# Altium schematic sheet k26_baseboard_power_supply.SchDoc: k26 Baseboard Power Supply (part 2 of 3)
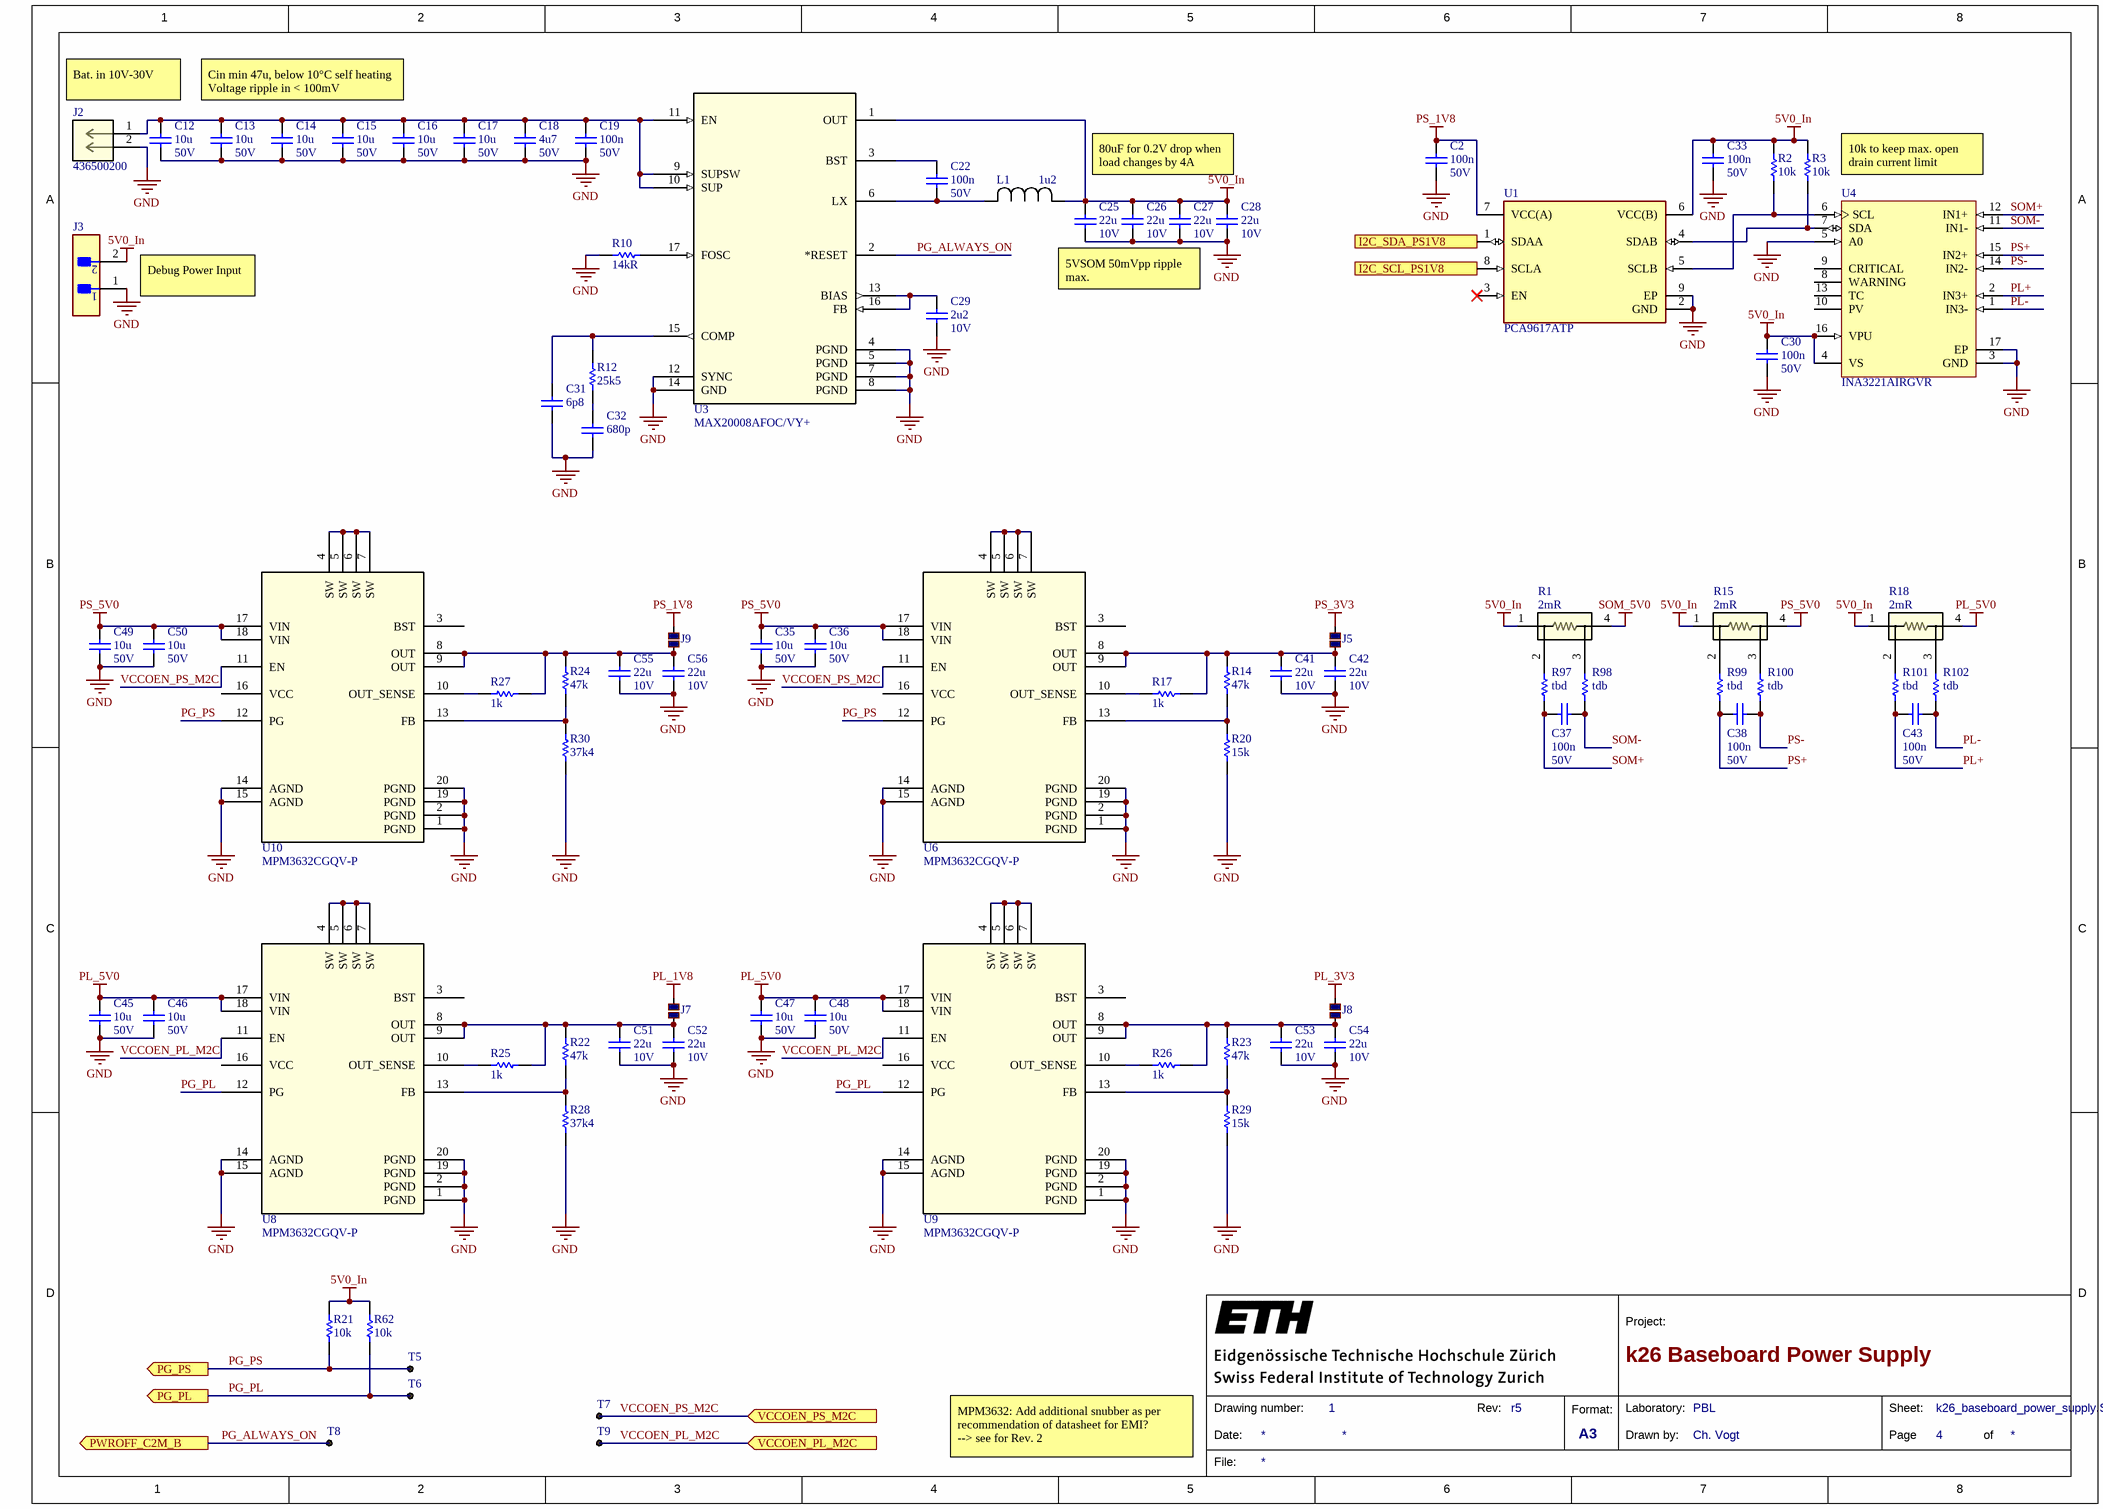
[diagram p1: k26_baseboard_power_supply.SchDoc]
## Library data of the parts
C2 C19 C22 C30 C33 C37 C38 C43 = cap0402: Ceramic Capacitor, Multilayer, Ceramic, 50V, 10% +Tol, 10% -Tol, X5R, 15% TC, 0.1uF, Surface Mount, 0402; Manufacturer: Yageo; Manufacturer Part Number: CC0402KRX5R9BB104; Capacitance: 100nF; Multilayer: Yes; Supplier 1: Farnell; Supplier Part Number 1: 3366442; RoHS: Yes; Category: Ceramic Capacitors; Stock 1: 180000; Pricing 1: 10000=0.00890, 50000=0.00870 (CHF); Mount: Surface Mount; Number of Pins: 2; Dielectric Material: Ceramic; Package Shape: Rectangular; Size Code: 0402; Terminal Finish: Nickel; Min Operating Temperature: -55°C; Max Operating Temperature: 85°C; JESD-609 Code: e3; Capacitor Type: Ceramic; Negative Tolerance: 10%; Temperature Characteristics Code: X5R; Termination: Wraparound; Positive Tolerance: 10%; Package Style: SMTMeter; Packaging: Tape and Reel; Length: 1mm; Width: 0.5mm; Height: 0.5mm; Reach SVHC Compliant: Yes; RoHS Compliant: Yes; ComponentLink1URL: https://datasheet.ciiva.com:443/pdfs/VipMasterIC/IC/YAGO/YAGO-S-A0006851646/YAGO-S-A0006851646-1.pdf?src-supplier=IHS+Markit; ComponentLink1Description: https://datasheet.ciiva.com:443/pdfs/VipMasterIC/IC/YAGO/YAGO-S-A0006851646/YAGO-S-A0006851646-1.pdf?src-supplier=IHS+Markit; ComponentLink2URL: http://www.yageo.com/documents/recent/UPY-GPHC_X5R_4V-to-50V_25.pdf?src-supplier=Digi-Key; ComponentLink2Description: http://www.yageo.com/documents/recent/UPY-GPHC_X5R_4V-to-50V_25.pdf?src-supplier=Digi-Key; ComponentLink3URL: http://www.yageo.com/documents/recent/UPY-GPHC_X5R_4V-to-50V_23.pdf?src-supplier=Digi-Key; ComponentLink3Description: http://www.yageo.com/documents/recent/UPY-GPHC_X5R_4V-to-50V_23.pdf?src-supplier=Digi-Key
C12-C17 C35 C36 C45-C50 = cap1206: Ceramic Capacitor, Multilayer, Ceramic, 50V, 10% +Tol, 10% -Tol, X5R, 15% TC, 10uF, Surface Mount, 1206; Manufacturer: Murata; Manufacturer Part Number: GRM31CR61H106KA12L; Multilayer: Yes; Supplier: Distrelec; Supplier Part Number: 16576840; RoHS: Yes; Category: Ceramic Capacitors; Stock: 15417; Pricing: 3=0.63200, 100=0.56000, 250=0.50000, 500=0.44000, 2500=0.38000 (CHF); Mounting Technology: Surface Mount; Pins: 2; Dielectric Material: Ceramic; Case/Package: 1206; Package Shape: Rectangular; Terminal Finish: Nickel; Min Operating Temperature: -55°C; Max Operating Temperature: 85°C; Value: 10uF; Capacitor Type: Ceramic; Tolerance  (fill in as +-): 10%; Packaging: Tape and Reel; Tolerance (fill in as +-): 10%; Temperature Characteristics Code: X5R; JESD-609 Code: e3; Termination: Wraparound; Package Style: SMTMeter; Length: 3.2mm; Width: 1.6mm; Height: 1.6mm; Reach SVHC Compliant: Yes; RoHS Compliant: Yes
  C12: ComponentLink1URL: https://datasheet.ciiva.com:443/pdfs/VipMasterIC/IC/MURE/MURE-S-A0004373697/MURE-S-A0004376961-1.pdf?src-supplier=IHS+Markit; ComponentLink1Description: https://datasheet.ciiva.com:443/pdfs/VipMasterIC/IC/MURE/MURE-S-A0004373697/MURE-S-A0004376961-1.pdf?src-supplier=IHS+Markit; ComponentLink2URL: https://datasheet.ciiva.com/7719/1747481-7719155.pdf?src-supplier=Element14; ComponentLink2Description: https://datasheet.ciiva.com/7719/1747481-7719155.pdf?src-supplier=Element14; ComponentLink3URL: https://datasheet.ciiva.com/5427/product-5427068.pdf?src-supplier=Mouser; ComponentLink3Description: https://datasheet.ciiva.com/5427/product-5427068.pdf?src-supplier=Mouser; ComponentLink4URL: https://datasheet.ciiva.com/6270/partnumbering-e-01-6270263.pdf?src-supplier=Digi-Key; ComponentLink4Description: https://datasheet.ciiva.com/6270/partnumbering-e-01-6270263.pdf?src-supplier=Digi-Key; ComponentLink5URL: https://datasheet.ciiva.com/6270/partnumbering-e-01-6270262.pdf?src-supplier=Digi-Key; ComponentLink5Description: https://datasheet.ciiva.com/6270/partnumbering-e-01-6270262.pdf?src-supplier=Digi-Key; ComponentLink6URL: https://datasheet.ciiva.com/6270/partnumbering-e-01-6270264.pdf?src-supplier=Digi-Key; ComponentLink6Description: https://datasheet.ciiva.com/6270/partnumbering-e-01-6270264.pdf?src-supplier=Digi-Key; ComponentLink7URL: https://datasheet.ciiva.com/16440/c02e-16440669.pdf?src-supplier=Future+Electronics; ComponentLink7Description: https://datasheet.ciiva.com/16440/c02e-16440669.pdf?src-supplier=Future+Electronics
  C13-C17 C35 C36 C45-C50: ComponentLink1URL: https://datasheet.ciiva.com:443/pdfs/VipMasterIC/IC/KEME/KEME-S-A0008991665/KEME-S-A0008991665-1.pdf?src-supplier=IHS+Markit; ComponentLink1Description: https://datasheet.ciiva.com:443/pdfs/VipMasterIC/IC/KEME/KEME-S-A0008991665/KEME-S-A0008991665-1.pdf?src-supplier=IHS+Markit; ComponentLink2URL: https://datasheet.ciiva.com/28608/1918694-28608743.pdf?src-supplier=Element14; ComponentLink2Description: https://datasheet.ciiva.com/28608/1918694-28608743.pdf?src-supplier=Element14; ComponentLink3URL: https://datasheet.ciiva.com/22705/1929483-22705482.pdf?src-supplier=Element14; ComponentLink3Description: https://datasheet.ciiva.com/22705/1929483-22705482.pdf?src-supplier=Element14; ComponentLink4URL: https://datasheet.ciiva.com:443/pdfs/VipMasterIC/IC/MURE/MURE-S-A0004373697/MURE-S-A0004376961-1.pdf?src-supplier=IHS+Markit; ComponentLink4Description: https://datasheet.ciiva.com:443/pdfs/VipMasterIC/IC/MURE/MURE-S-A0004373697/MURE-S-A0004376961-1.pdf?src-supplier=IHS+Markit; ComponentLink5URL: https://datasheet.ciiva.com/7719/1747481-7719155.pdf?src-supplier=Element14; ComponentLink5Description: https://datasheet.ciiva.com/7719/1747481-7719155.pdf?src-supplier=Element14; ComponentLink6URL: https://datasheet.ciiva.com/5427/product-5427068.pdf?src-supplier=Mouser; ComponentLink6Description: https://datasheet.ciiva.com/5427/product-5427068.pdf?src-supplier=Mouser; ComponentLink7URL: https://datasheet.ciiva.com/6270/partnumbering-e-01-6270263.pdf?src-supplier=Digi-Key; ComponentLink7Description: https://datasheet.ciiva.com/6270/partnumbering-e-01-6270263.pdf?src-supplier=Digi-Key; ComponentLink8URL: https://datasheet.ciiva.com/6270/partnumbering-e-01-6270262.pdf?src-supplier=Digi-Key; ComponentLink8Description: https://datasheet.ciiva.com/6270/partnumbering-e-01-6270262.pdf?src-supplier=Digi-Key; ComponentLink9URL: https://datasheet.ciiva.com/6270/partnumbering-e-01-6270264.pdf?src-supplier=Digi-Key; ComponentLink9Description: https://datasheet.ciiva.com/6270/partnumbering-e-01-6270264.pdf?src-supplier=Digi-Key; ComponentLink10URL: https://datasheet.ciiva.com/16440/c02e-16440669.pdf?src-supplier=Future+Electronics; ComponentLink10Description: https://datasheet.ciiva.com/16440/c02e-16440669.pdf?src-supplier=Future+Electronics
C18 = cap1206: Ceramic Capacitor, Multilayer, Ceramic, 50V, 10% +Tol, 10% -Tol, X7R, 15% TC, 4.7uF, Surface Mount, 1206; Manufacturer: Murata; Manufacturer Part Number: GRM31CR71H475KA12L; Multilayer: Yes; Supplier: Farnell; Supplier Part Number: 1735545; RoHS: Yes; Category: Ceramic Capacitors; Stock: 54786; Pricing: 5=0.19300, 50=0.16600, 250=0.14500, 500=0.12400, 1000=0.10500 (CHF); Mounting Technology: Surface Mount; Pins: 2; Dielectric Material: Ceramic; Package Shape: Rectangular; Case/Package: 1206; Terminal Finish: Nickel; Min Operating Temperature: -55°C; Max Operating Temperature: 125°C; Value: 4.7uF; Capacitor Type: Ceramic; Tolerance  (fill in as +-): 10%; Packaging: Tape and Reel; Tolerance (fill in as +-): 10%; Temperature Characteristics Code: X7R; Termination: Wraparound; JESD-609 Code: e3; Package Style: SMTMeter; Length: 3.2mm; Width: 1.6mm; Height: 1.6mm; Reach SVHC Compliant: Yes; RoHS Compliant: Yes; ComponentLink1URL: https://psearch.en.murata.com:443/capacitor/product/GRM31CR71H475KA12%23.pdf?src-supplier=IHS+Markit; ComponentLink1Description: https://psearch.en.murata.com:443/capacitor/product/GRM31CR71H475KA12%23.pdf?src-supplier=IHS+Markit; ComponentLink2URL: https://datasheet.ciiva.com/6072/415379-6072784.pdf?src-supplier=Farnell; ComponentLink2Description: https://datasheet.ciiva.com/6072/415379-6072784.pdf?src-supplier=Farnell; ComponentLink3URL: https://datasheet.ciiva.com/3777/2267grm31cr71h475ka1223-3777241.pdf?src-supplier=Arrow+Electronics; ComponentLink3Description: https://datasheet.ciiva.com/3777/2267grm31cr71h475ka1223-3777241.pdf?src-supplier=Arrow+Electronics; ComponentLink4URL: https://datasheet.ciiva.com/29202/450972-da-01-de-vs-chip-kond-1206-4-7-uf-10pr-50-0v-x7r-29202576.pdf?src-supplier=Conrad; ComponentLink4Description: https://datasheet.ciiva.com/29202/450972-da-01-de-vs-chip-kond-1206-4-7-uf-10pr-50-0v-x7r-29202576.pdf?src-supplier=Conrad; ComponentLink5URL: https://datasheet.ciiva.com/29202/451279-da-01-de-vs-kondens-grm31-cr71h-475ka12l-29202365.pdf?src-supplier=Conrad; ComponentLink5Description: https://datasheet.ciiva.com/29202/451279-da-01-de-vs-kondens-grm31-cr71h-475ka12l-29202365.pdf?src-supplier=Conrad; ComponentLink6URL: https://datasheet.ciiva.com/7937/415310-7937749.pdf?src-supplier=Element14; ComponentLink6Description: https://datasheet.ciiva.com/7937/415310-7937749.pdf?src-supplier=Element14; ComponentLink7URL: https://datasheet.ciiva.com/6270/partnumbering-e-01-6270218.pdf?src-supplier=Digi-Key; ComponentLink7Description: https://datasheet.ciiva.com/6270/partnumbering-e-01-6270218.pdf?src-supplier=Digi-Key; ComponentLink8URL: https://datasheet.ciiva.com/6270/partnumbering-e-01-6270217.pdf?src-supplier=Digi-Key; ComponentLink8Description: https://datasheet.ciiva.com/6270/partnumbering-e-01-6270217.pdf?src-supplier=Digi-Key; ComponentLink9URL: https://datasheet.ciiva.com/6270/partnumbering-e-01-6270219.pdf?src-supplier=Digi-Key; ComponentLink9Description: https://datasheet.ciiva.com/6270/partnumbering-e-01-6270219.pdf?src-supplier=Digi-Key
C25-C28 C41 C42 C51-C56 = cap1206: Ceramic Capacitor, Multilayer, Ceramic, 10V, 10% +Tol, 10% -Tol, X7R, 15% TC, 22uF, Surface Mount, 1206; Manufacturer: Kyocera AVX; Manufacturer Part Number: 1206ZC226KAT2A; Multilayer: Yes; Supplier: Farnell; Supplier Part Number: 2094045; RoHS: Yes; Category: Ceramic Capacitors; Stock: 26392; Pricing: 5=0.49100, 50=0.42200, 250=0.37800, 500=0.33400, 1000=0.26300, 2500=0.23300, 12500=0.22800, 25000=0.22400 (CHF); Mounting Technology: Surface Mount; Pins: 2; Dielectric Material: Ceramic; Case/Package: 1206; Package Shape: Rectangular; Terminal Finish: Nickel; Min Operating Temperature: -55°C; Max Operating Temperature: 125°C; Value: 22uF; Capacitor Type: Ceramic; Tolerance  (fill in as +-): 10%; Packaging: Tape and Reel; Tolerance (fill in as +-): 10%; Termination: Wraparound; Temperature Characteristics Code: X7R; Package Style: SMTMeter; JESD-609 Code: e3; Length: 3.2mm; Width: 1.6mm; Height: 1.8mm; Reach SVHC Compliant: Yes; RoHS Compliant: Yes
  C25: ComponentLink1URL: https://datasheet.ciiva.com:443/pdfs/VipMasterIC/IC/AVXC/AVXC-S-A0009640452/AVXC-S-A0009640452-1.pdf?src-supplier=IHS+Markit; ComponentLink1Description: https://datasheet.ciiva.com:443/pdfs/VipMasterIC/IC/AVXC/AVXC-S-A0009640452/AVXC-S-A0009640452-1.pdf?src-supplier=IHS+Markit; ComponentLink2URL: https://datasheet.ciiva.com/25613/0900766b810a29b7-25613146.pdf?src-supplier=Rs; ComponentLink2Description: https://datasheet.ciiva.com/25613/0900766b810a29b7-25613146.pdf?src-supplier=Rs; ComponentLink3URL: https://datasheet.ciiva.com/7833/cx7r-7833598.pdf?src-supplier=Element14; ComponentLink3Description: https://datasheet.ciiva.com/7833/cx7r-7833598.pdf?src-supplier=Element14; ComponentLink4URL: https://datasheet.ciiva.com/5430/cx7r-218113-5430349.pdf?src-supplier=Mouser; ComponentLink4Description: https://datasheet.ciiva.com/5430/cx7r-218113-5430349.pdf?src-supplier=Mouser
  C26-C28 C41 C42 C51-C56: ComponentLink1URL: https://datasheet.ciiva.com:443/pdfs/VipMasterIC/IC/KEME/KEME-S-A0008991665/KEME-S-A0008991665-1.pdf?src-supplier=IHS+Markit; ComponentLink1Description: https://datasheet.ciiva.com:443/pdfs/VipMasterIC/IC/KEME/KEME-S-A0008991665/KEME-S-A0008991665-1.pdf?src-supplier=IHS+Markit; ComponentLink2URL: https://datasheet.ciiva.com/28608/1918694-28608743.pdf?src-supplier=Element14; ComponentLink2Description: https://datasheet.ciiva.com/28608/1918694-28608743.pdf?src-supplier=Element14; ComponentLink3URL: https://datasheet.ciiva.com/22705/1929483-22705482.pdf?src-supplier=Element14; ComponentLink3Description: https://datasheet.ciiva.com/22705/1929483-22705482.pdf?src-supplier=Element14; ComponentLink4URL: https://datasheet.ciiva.com:443/pdfs/VipMasterIC/IC/AVXC/AVXC-S-A0009640452/AVXC-S-A0009640452-1.pdf?src-supplier=IHS+Markit; ComponentLink4Description: https://datasheet.ciiva.com:443/pdfs/VipMasterIC/IC/AVXC/AVXC-S-A0009640452/AVXC-S-A0009640452-1.pdf?src-supplier=IHS+Markit; ComponentLink5URL: https://datasheet.ciiva.com/25613/0900766b810a29b7-25613146.pdf?src-supplier=Rs; ComponentLink5Description: https://datasheet.ciiva.com/25613/0900766b810a29b7-25613146.pdf?src-supplier=Rs; ComponentLink6URL: https://datasheet.ciiva.com/7833/cx7r-7833598.pdf?src-supplier=Element14; ComponentLink6Description: https://datasheet.ciiva.com/7833/cx7r-7833598.pdf?src-supplier=Element14; ComponentLink7URL: https://datasheet.ciiva.com/5430/cx7r-218113-5430349.pdf?src-supplier=Mouser; ComponentLink7Description: https://datasheet.ciiva.com/5430/cx7r-218113-5430349.pdf?src-supplier=Mouser
C29 = cap0402: Ceramic Capacitor, Multilayer, Ceramic, 10V, 10% +Tol, 10% -Tol, X7S, 22% TC, 2.2uF, Surface Mount, 0402; Manufacturer: TDK; Manufacturer Part Number: C1005X7S1A225K050BC; Multilayer: Yes; Supplier: Rs; Supplier Part Number: 9156436P; RoHS: Yes; Category: Ceramic Capacitors; Stock: 5000; Pricing: 150=0.11900, 500=0.10700, 2500=0.08300 (CHF); Mounting Technology: Surface Mount; Pins: 2; Dielectric Material: Ceramic; Case/Package: 0402; Package Shape: Rectangular; Terminal Finish: Nickel; Min Operating Temperature: -55°C; Max Operating Temperature: 125°C; Value: 2.2uF; Capacitor Type: Ceramic; Tolerance  (fill in as +-): 10%; Packaging: Tape and Reel; Tolerance (fill in as +-): 10%; Temperature Characteristics Code: X7S; JESD-609 Code: e3; Termination: Wraparound; Package Style: SMTMeter; Length: 1mm; Width: 0.5mm; Height: 0.5mm; Reach SVHC Compliant: Yes; RoHS Compliant: Yes; ComponentLink1URL: https://datasheet.ciiva.com:443/pdfs/VipMasterIC/IC/TDKC/TDKC-S-A0008796792/TDKC-S-A0008796792-1.pdf?src-supplier=IHS+Markit; ComponentLink1Description: https://datasheet.ciiva.com:443/pdfs/VipMasterIC/IC/TDKC/TDKC-S-A0008796792/TDKC-S-A0008796792-1.pdf?src-supplier=IHS+Markit; ComponentLink2URL: https://datasheet.ciiva.com/24218/c1005x7s1a225k050bc-264486-24218484.pdf?src-supplier=Mouser; ComponentLink2Description: https://datasheet.ciiva.com/24218/c1005x7s1a225k050bc-264486-24218484.pdf?src-supplier=Mouser; ComponentLink3URL: https://datasheet.ciiva.com/6274/tdkmlcccaprange-6274910.pdf?src-supplier=Digi-Key; ComponentLink3Description: https://datasheet.ciiva.com/6274/tdkmlcccaprange-6274910.pdf?src-supplier=Digi-Key
C31 = cap0402: Ceramic Capacitor, Multilayer, Ceramic, 50V, 3.68% +Tol, 3.68% -Tol, C0G, 30ppm/Cel TC, 0.0000068uF, Surface Mount, 0402; Manufacturer: Kyocera AVX; Manufacturer Part Number: 04025A6R8CAT2A; Tolerance  (fill in as +-): 3.6765%; Multilayer: Yes; Supplier: Rs; Supplier Part Number: 1356740; RoHS: Yes; Category: Ceramic Capacitors; Stock: 6400; Pricing: 200=0.03200 (CHF); Mounting Technology: Surface Mount; Pins: 2; Dielectric Material: Ceramic; Case/Package: 0402; Terminal Finish: Nickel; Package Shape: Rectangular; Min Operating Temperature: -55°C; Max Operating Temperature: 125°C; JESD-609 Code: e3; Value: 6p8; Capacitor Type: Ceramic; Package Style: SMTMeter; Packaging: Tape and Reel; Tolerance (fill in as +-): 3.6765%; Rated DC Voltage (URdc): 50V; Temperature Characteristics Code: C0G; Termination: Wraparound; Length: 1mm; Width: 0.5mm; Height: 0.56mm; Reach SVHC Compliant: Yes; RoHS Compliant: Yes; ComponentLink1URL: https://datasheet.ciiva.com:443/pdfs/VipMasterIC/IC/AVXC/AVXC-S-A0008899940/AVXC-S-A0008899940-1.pdf?src-supplier=IHS+Markit; ComponentLink1Description: https://datasheet.ciiva.com:443/pdfs/VipMasterIC/IC/AVXC/AVXC-S-A0008899940/AVXC-S-A0008899940-1.pdf?src-supplier=IHS+Markit; ComponentLink2URL: https://datasheet.ciiva.com/11788/0900766b80def0e2-11788526.pdf?src-supplier=Rs; ComponentLink2Description: https://datasheet.ciiva.com/11788/0900766b80def0e2-11788526.pdf?src-supplier=Rs; ComponentLink3URL: https://datasheet.ciiva.com/2987/ccog-2987665.pdf?src-supplier=Avnet; ComponentLink3Description: https://datasheet.ciiva.com/2987/ccog-2987665.pdf?src-supplier=Avnet; ComponentLink4URL: https://datasheet.ciiva.com/151/ccog-151780.pdf?src-supplier=Digi-Key; ComponentLink4Description: https://datasheet.ciiva.com/151/ccog-151780.pdf?src-supplier=Digi-Key; ComponentLink5URL: https://datasheet.ciiva.com/1123/84496-1123652.pdf?src-supplier=Element14; ComponentLink5Description: https://datasheet.ciiva.com/1123/84496-1123652.pdf?src-supplier=Element14; ComponentLink6URL: https://datasheet.ciiva.com/151/ccog-151781.pdf?src-supplier=Digi-Key; ComponentLink6Description: https://datasheet.ciiva.com/151/ccog-151781.pdf?src-supplier=Digi-Key; ComponentLink7URL: https://datasheet.ciiva.com/1123/84496-1123653.pdf?src-supplier=Element14; ComponentLink7Description: https://datasheet.ciiva.com/1123/84496-1123653.pdf?src-supplier=Element14; ComponentLink8URL: https://datasheet.ciiva.com/151/ccog-151782.pdf?src-supplier=Digi-Key; ComponentLink8Description: https://datasheet.ciiva.com/151/ccog-151782.pdf?src-supplier=Digi-Key
C32 = cap0402: Ceramic Capacitor, Multilayer, Ceramic, 50V, 10% +Tol, 10% -Tol, X7R, 15% TC, 0.00068uF, Surface Mount, 0402; Manufacturer: Kyocera AVX; Manufacturer Part Number: 04025C681KAT2A; Value: 680pF; Multilayer: Yes; Supplier: Farnell; Supplier Part Number: 2332527; RoHS: Yes; Category: Ceramic Capacitors; Stock: 19082; Pricing: 10=0.01490, 100=0.01210, 500=0.00650, 2500=0.00600, 5000=0.00560 (CHF); Mounting Technology: Surface Mount; Pins: 2; Dielectric Material: Ceramic; Package Shape: Rectangular; Case/Package: 0402; Terminal Finish: Nickel; Min Operating Temperature: -55°C; Max Operating Temperature: 125°C; JESD-609 Code: e3; Capacitor Type: Ceramic; Tolerance  (fill in as +-): 10%; Package Style: SMTMeter; Packaging: Tape and Reel; Tolerance (fill in as +-): 10%; Rated DC Voltage (URdc): 50V; Temperature Characteristics Code: X7R; Termination: Wraparound; Length: 1mm; Width: 0.5mm; Height: 0.56mm; Reach SVHC Compliant: Yes; RoHS Compliant: Yes; ComponentLink1URL: https://datasheet.ciiva.com:443/pdfs/VipMasterIC/IC/AVXC/AVXC-S-A0009640452/AVXC-S-A0009640452-1.pdf?src-supplier=IHS+Markit; ComponentLink1Description: https://datasheet.ciiva.com:443/pdfs/VipMasterIC/IC/AVXC/AVXC-S-A0009640452/AVXC-S-A0009640452-1.pdf?src-supplier=IHS+Markit; ComponentLink2URL: https://datasheet.ciiva.com/150/cx7r-150548.pdf?src-supplier=Digi-Key; ComponentLink2Description: https://datasheet.ciiva.com/150/cx7r-150548.pdf?src-supplier=Digi-Key; ComponentLink3URL: https://datasheet.ciiva.com/150/cx7r-150549.pdf?src-supplier=Digi-Key; ComponentLink3Description: https://datasheet.ciiva.com/150/cx7r-150549.pdf?src-supplier=Digi-Key; ComponentLink4URL: https://datasheet.ciiva.com/150/cx7r-150550.pdf?src-supplier=Digi-Key; ComponentLink4Description: https://datasheet.ciiva.com/150/cx7r-150550.pdf?src-supplier=Digi-Key; ComponentLink5URL: https://datasheet.ciiva.com/2987/cx7r-2987686.pdf?src-supplier=Avnet; ComponentLink5Description: https://datasheet.ciiva.com/2987/cx7r-2987686.pdf?src-supplier=Avnet; ComponentLink6URL: https://datasheet.ciiva.com/14597/70001075-14597471.pdf?src-supplier=Allied+Electronics; ComponentLink6Description: https://datasheet.ciiva.com/14597/70001075-14597471.pdf?src-supplier=Allied+Electronics; ComponentLink7URL: https://datasheet.ciiva.com/11499/cx7r-11499782.pdf?src-supplier=Avnet; ComponentLink7Description: https://datasheet.ciiva.com/11499/cx7r-11499782.pdf?src-supplier=Avnet; ComponentLink8URL: https://datasheet.ciiva.com/28454/1679506-28454055.pdf?src-supplier=Element14; ComponentLink8Description: https://datasheet.ciiva.com/28454/1679506-28454055.pdf?src-supplier=Element14; ComponentLink9URL: https://datasheet.ciiva.com/5410/cx7r-5410860.pdf?src-supplier=Mouser; ComponentLink9Description: https://datasheet.ciiva.com/5410/cx7r-5410860.pdf?src-supplier=Mouser; ComponentLink10URL: https://datasheet.ciiva.com/28533/1818074-28533820.pdf?src-supplier=Element14; ComponentLink10Description: https://datasheet.ciiva.com/28533/1818074-28533820.pdf?src-supplier=Element14; ComponentLink11URL: https://datasheet.ciiva.com/15212/getdatasheetpartid-169594-15212077.pdf?src-supplier=Verical; ComponentLink11Description: https://datasheet.ciiva.com/15212/getdatasheetpartid-169594-15212077.pdf?src-supplier=Verical; ComponentLink12URL: https://datasheet.ciiva.com/22619/1679506-22619775.pdf?src-supplier=Element14; ComponentLink12Description: https://datasheet.ciiva.com/22619/1679506-22619775.pdf?src-supplier=Element14
J2 = 436500200: Board Connector, 2 Contact(s), 1 Row(s), Male, Right Angle, Solder Terminal; Mfr_Name: Molex Connector Corporation; Manufacturer: Molex; Manufacturer Part Number: 0436500200; Option: General Purpose; Filter Feature: No; Mating Information: MULTIPLE MATING PARTS AVAILABLE; Number of Rows Loaded: 1; Number of Contacts: 2; Additional Feature: SHROUDED; Copyright: Copyright (C) 2024 Ultra Librarian. All rights reserved.; Manufacturer_Part_Number: 436500200; RefDes: RefDes; Type: DEV; Supplier: Mouser; Supplier Part Number: 538-43650-0200; RoHS: Yes; Stock: 2371; Pricing: 1=1.1, 10=0.742, 50=0.742, 100=0.678, 1000=0.645, 10000=0.5 (USD); Mounting Technology: Board; Contact Material: Brass; Contact Finish - Mating: TIN (100); Contact Finish - Termination: TIN (100); Connector Type: BOARD CONNECTOR; Contact Gender: Male; Mixed Contacts: No; Mounting Style: RIGHT ANGLE; Termination: Solder; JESD-609 Code: e3; Terminal Pitch: 3mm; Flammability Rating: UL94 V-0; DIN Conformance: No; IEC Conformance: No; MIL Conformance: No; Reach SVHC Compliant: Yes; RoHS Compliant: Yes; ComponentLink1URL: https://datasheet.ciiva.com:443/pdfs/VipMasterIC/IC/MOLE/MOLE-S-A0006764423/MOLE-S-A0006762381-1.pdf?src-supplier=IHS+Markit; ComponentLink1Description: https://datasheet.ciiva.com:443/pdfs/VipMasterIC/IC/MOLE/MOLE-S-A0006764423/MOLE-S-A0006762381-1.pdf?src-supplier=IHS+Markit
J3 = CMP-1681-00004-5: CONN HEADER VERT 2POS 2.54MM; Number of Positions: 2; Max Voltage Rating (AC): 550V; Max Current Rating: 7.6A; Gender: Male; Contact Type: Male Pin; REACH SVHC: No SVHC; Connector Type: Header; Number of Rows: 1; Flammability Rating: UL94 V-0; Pitch: 2.54mm; Orientation: Straight; Termination: Solder; Insulation Material: PBT; RoHS Compliant: Yes; Housing Color: Black; Mount: Through Hole; Contact Mating Length: 0.23inch; Contact Shape: Square; Contact Material: Bronze; Min Operating Temperature: -55°C; Number of Contacts: 2; Depth: 2.54mm; Housing Material: Polyester; Packaging: Bulk; Length: 5.08mm; Radiation Hardening: No; Insulation Color: Black; Series: TSW; Color: Black; Max Operating Temperature: 125°C; Package Quantity: 1; Fastening Type: Pull; Contact Plating: Gold; Lead Free: Lead Free; Contact Finish - Mating: GOLD; Width: 2.54mm
J5 J7-J9 = CMP-00005-5: Value: 1; Technology: SMT
L1 = XGL5050-122MEC: General Purpose Inductor, 1.2uH, 20%, 1 Element, Composite-Core, SMD, 2221; Mfr_Name: Coilcraft; Type: DEV; Copyright: Copyright (C) 2023 Ultra Librarian. All rights reserved.; Manufacturer_Part_Number: XGL5050-122MEC; RefDes: RefDes; Supplier: Coilcraft Direct; Supplier Part Number: XGL5050-122MEC; Manufacturer: Coilcraft; Manufacturer Part Number: XGL5050-122MEC; RoHS: Yes; Category: Inductors; Stock: 1973; Pricing: 1=2.74000, 100=2.40000, 250=1.81000, 500=1.09000, 1000=0.85000, 2500=0.73000 (USD)
R1 R15 R18 = CST0612-FC-R002E: No Description Available; Mfr_Name: Bourns Electronics; Copyright: Copyright (C) 2023 Ultra Librarian. All rights reserved.; Manufacturer_Part_Number: CST0612-FC-R002E; RefDes: RefDes; Type: DEV
R2 R3 = res0402: Fixed Resistor, Metal Glaze/thick Film, 0.1W, 10000ohm, 50V, 1% +/-Tol, 100ppm/Cel, Surface Mount, 0402; Manufacturer: Panasonic; Manufacturer Part Number: ERJ-2RKF1002X; Power: 100mW; Rated Temperature: 70°C; Value: 10kR; Temperature Coefficient: 100ppm/°C; Package Height: 0.35mm; Package Length: 1mm; Package Width: 0.5mm; Reference Standard: AEC-Q200; Supplier: Rs; Supplier Part Number: 7325246; RoHS: Yes; Category: Chip SMD Resistors; Stock: 1630000; Pricing: 10000=0.00600, 30000=0.00500 (CHF); Mounting Technology: Surface Mount; Pins: 2; Package Shape: Rectangular; Case/Package: 0402; Terminal Finish: Nickel; Min Operating Temperature: -55°C; Max Operating Temperature: 155°C; Tolerance: 1%; JESD-609 Code: e3; Resistor Type: FIXED RESISTOR; Construction: Rectangular; Package Style: SMTMeter; Packaging: Tape and Reel; Technology: METAL GLAZE/THICK FILM; Termination: Wraparound; Working Voltage: 50V; Reach SVHC Compliant: Yes; RoHS Compliant: Yes; ComponentLink1URL: https://datasheet.ciiva.com:443/pdfs/VipMasterIC/IC/PANA/PANA-S-A0009889626/PANA-S-A0009889626-1.pdf?src-supplier=IHS+Markit; ComponentLink1Description: https://datasheet.ciiva.com:443/pdfs/VipMasterIC/IC/PANA/PANA-S-A0009889626/PANA-S-A0009889626-1.pdf?src-supplier=IHS+Markit; ComponentLink2URL: https://datasheet.ciiva.com/27055/1987020-27055643.pdf?src-supplier=Jameco; ComponentLink2Description: https://datasheet.ciiva.com/27055/1987020-27055643.pdf?src-supplier=Jameco; ComponentLink3URL: https://datasheet.ciiva.com/43467/1678782-43467402.pdf?src-supplier=Farnell; ComponentLink3Description: https://datasheet.ciiva.com/43467/1678782-43467402.pdf?src-supplier=Farnell; ComponentLink4URL: https://datasheet.ciiva.com/28514/1678782-28514185.pdf?src-supplier=Element14; ComponentLink4Description: https://datasheet.ciiva.com/28514/1678782-28514185.pdf?src-supplier=Element14; ComponentLink5URL: https://datasheet.ciiva.com/24023/aoa0000ce2-24023017.pdf?src-supplier=Mouser; ComponentLink5Description: https://datasheet.ciiva.com/24023/aoa0000ce2-24023017.pdf?src-supplier=Mouser; ComponentLink6URL: https://datasheet.ciiva.com/16782/70260748-16782590.pdf?src-supplier=Allied+Electronics; ComponentLink6Description: https://datasheet.ciiva.com/16782/70260748-16782590.pdf?src-supplier=Allied+Electronics; ComponentLink7URL: https://datasheet.ciiva.com/16786/70260748-16786734.pdf?src-supplier=Allied+Electronics; ComponentLink7Description: https://datasheet.ciiva.com/16786/70260748-16786734.pdf?src-supplier=Allied+Electronics; ComponentLink8URL: https://datasheet.ciiva.com/9194/aoa0000ce2-9194142.pdf?src-supplier=Avnet; ComponentLink8Description: https://datasheet.ciiva.com/9194/aoa0000ce2-9194142.pdf?src-supplier=Avnet; ComponentLink9URL: https://datasheet.ciiva.com/16199/aoa0000ce2-16199478.pdf?src-supplier=Future+Electronics; ComponentLink9Description: https://datasheet.ciiva.com/16199/aoa0000ce2-16199478.pdf?src-supplier=Future+Electronics; ComponentLink10URL: https://datasheet.ciiva.com/48531/aoa0000ce2-48531069.pdf?src-supplier=Avnet; ComponentLink10Description: https://datasheet.ciiva.com/48531/aoa0000ce2-48531069.pdf?src-supplier=Avnet; ComponentLink11URL: https://datasheet.ciiva.com/30201/aoa0000ce2-30201022.pdf?src-supplier=Onlinecomponents.com; ComponentLink11Description: https://datasheet.ciiva.com/30201/aoa0000ce2-30201022.pdf?src-supplier=Onlinecomponents.com
R10 = res0402: Fixed Resistor, Metal Glaze/thick Film, 0.063W, 14000ohm, 50V, 1% +/-Tol, 100ppm/Cel, Surface Mount, 0402; Manufacturer: Vishay; Manufacturer Part Number: CRCW040214K0FKED; Power: 63mW; Temperature Coefficient: 100ppm/°C; Rated Temperature: 70°C; Package Height: 0.35mm; Package Length: 1mm; Package Width: 0.5mm; Reference Standard: AEC-Q200; Supplier: Mouser; Supplier Part Number: 71-CRCW0402-14K-E3; RoHS: Yes; Category: Chip SMD Resistors; Stock: 8931; Pricing: 1=0.10000, 10=0.03800, 50=0.03800, 100=0.01600, 1000=0.00700, 10000=0.00400 (USD); Mounting Technology: Surface Mount; Pins: 2; Case/Package: 0402; Terminal Finish: Nickel; Package Shape: Rectangular; Min Operating Temperature: -55°C; Max Operating Temperature: 155°C; Tolerance: 1%; Resistor Type: FIXED RESISTOR; Packaging: Tape and Reel; Value: 14kR; Technology: METAL GLAZE/THICK FILM; Termination: Wraparound; Working Voltage: 50V; Construction: Chip; Package Style: SMTMeter; JESD-609 Code: e3; RoHS Compliant: Yes; Reach SVHC Compliant: Yes; ComponentLink1URL: https://datasheet.ciiva.com:443/pdfs/VipMasterIC/IC/VISH/VISH-S-A0007266705/VISH-S-A0007266705-1.pdf?src-supplier=IHS+Markit; ComponentLink1Description: https://datasheet.ciiva.com:443/pdfs/VipMasterIC/IC/VISH/VISH-S-A0007266705/VISH-S-A0007266705-1.pdf?src-supplier=IHS+Markit; ComponentLink2URL: https://datasheet.ciiva.com/11810/0900766b80d98824-11810015.pdf?src-supplier=Rs; ComponentLink2Description: https://datasheet.ciiva.com/11810/0900766b80d98824-11810015.pdf?src-supplier=Rs; ComponentLink3URL: https://datasheet.ciiva.com/7664/1697337-7664007.pdf?src-supplier=Element14; ComponentLink3Description: https://datasheet.ciiva.com/7664/1697337-7664007.pdf?src-supplier=Element14; ComponentLink4URL: https://datasheet.ciiva.com/16207/dcrcwe3-16207431.pdf?src-supplier=Future+Electronics; ComponentLink4Description: https://datasheet.ciiva.com/16207/dcrcwe3-16207431.pdf?src-supplier=Future+Electronics; ComponentLink5URL: https://datasheet.ciiva.com/5544/dcrcwe3-109170-5544680.pdf?src-supplier=Mouser; ComponentLink5Description: https://datasheet.ciiva.com/5544/dcrcwe3-109170-5544680.pdf?src-supplier=Mouser; ComponentLink6URL: https://datasheet.ciiva.com/7663/1697337-7663832.pdf?src-supplier=Element14; ComponentLink6Description: https://datasheet.ciiva.com/7663/1697337-7663832.pdf?src-supplier=Element14; ComponentLink7URL: https://datasheet.ciiva.com/3256/dcrcwe3-3256059.pdf?src-supplier=Avnet; ComponentLink7Description: https://datasheet.ciiva.com/3256/dcrcwe3-3256059.pdf?src-supplier=Avnet; ComponentLink8URL: https://datasheet.ciiva.com/2495/dcrcwe3-2495389.pdf?src-supplier=Digi-Key; ComponentLink8Description: https://datasheet.ciiva.com/2495/dcrcwe3-2495389.pdf?src-supplier=Digi-Key; ComponentLink9URL: https://datasheet.ciiva.com/2495/dcrcwe3-2495390.pdf?src-supplier=Digi-Key; ComponentLink9Description: https://datasheet.ciiva.com/2495/dcrcwe3-2495390.pdf?src-supplier=Digi-Key; ComponentLink10URL: https://datasheet.ciiva.com/2495/dcrcwe3-2495391.pdf?src-supplier=Digi-Key; ComponentLink10Description: https://datasheet.ciiva.com/2495/dcrcwe3-2495391.pdf?src-supplier=Digi-Key
R12 = res0402: Fixed Resistor, Metal Glaze/thick Film, 0.063W, 25500ohm, 50V, 1% +/-Tol, 100ppm/Cel, Surface Mount, 0402; Manufacturer: Vishay; Manufacturer Part Number: CRCW040225K5FKED; Power: 63mW; Value: 25.5kR; Temperature Coefficient: 100ppm/°C; Rated Temperature: 70°C; Package Height: 0.35mm; Package Length: 1mm; Package Width: 0.5mm; Reference Standard: AEC-Q200; Supplier: Rs; Supplier Part Number: 6789030; RoHS: Yes; Category: Chip SMD Resistors; Stock: 20000; Pricing: 50=0.04200, 1250=0.01800, 2500=0.00900, 4000=0.01300, 5000=0.00800 (CHF); Mounting Technology: Surface Mount; Pins: 2; Case/Package: 0402; Terminal Finish: Nickel; Package Shape: Rectangular; Min Operating Temperature: -55°C; Max Operating Temperature: 155°C; Tolerance: 1%; Resistor Type: FIXED RESISTOR; Packaging: Tape and Reel; Termination: Wraparound; Working Voltage: 50V; Technology: METAL GLAZE/THICK FILM; JESD-609 Code: e3; Construction: Chip; Package Style: SMTMeter; RoHS Compliant: Yes; Reach SVHC Compliant: Yes; ComponentLink1URL: https://datasheet.ciiva.com:443/pdfs/VipMasterIC/IC/VISH/VISH-S-A0007266705/VISH-S-A0007266705-1.pdf?src-supplier=IHS+Markit; ComponentLink1Description: https://datasheet.ciiva.com:443/pdfs/VipMasterIC/IC/VISH/VISH-S-A0007266705/VISH-S-A0007266705-1.pdf?src-supplier=IHS+Markit; ComponentLink2URL: https://datasheet.ciiva.com/11818/0900766b80d98824-11818027.pdf?src-supplier=Rs; ComponentLink2Description: https://datasheet.ciiva.com/11818/0900766b80d98824-11818027.pdf?src-supplier=Rs; ComponentLink3URL: https://datasheet.ciiva.com/7671/1533075-7671768.pdf?src-supplier=Element14; ComponentLink3Description: https://datasheet.ciiva.com/7671/1533075-7671768.pdf?src-supplier=Element14; ComponentLink4URL: https://datasheet.ciiva.com/7671/1697337-7671565.pdf?src-supplier=Element14; ComponentLink4Description: https://datasheet.ciiva.com/7671/1697337-7671565.pdf?src-supplier=Element14; ComponentLink5URL: https://datasheet.ciiva.com/5547/dcrcwe3-109170-5547513.pdf?src-supplier=Mouser; ComponentLink5Description: https://datasheet.ciiva.com/5547/dcrcwe3-109170-5547513.pdf?src-supplier=Mouser; ComponentLink6URL: https://datasheet.ciiva.com/7172/1533075-7172954.pdf?src-supplier=Newark; ComponentLink6Description: https://datasheet.ciiva.com/7172/1533075-7172954.pdf?src-supplier=Newark; ComponentLink7URL: https://datasheet.ciiva.com/2463/dcrcwe3-2463772.pdf?src-supplier=Digi-Key; ComponentLink7Description: https://datasheet.ciiva.com/2463/dcrcwe3-2463772.pdf?src-supplier=Digi-Key; ComponentLink8URL: https://datasheet.ciiva.com/2463/dcrcwe3-2463773.pdf?src-supplier=Digi-Key; ComponentLink8Description: https://datasheet.ciiva.com/2463/dcrcwe3-2463773.pdf?src-supplier=Digi-Key; ComponentLink9URL: https://datasheet.ciiva.com/8336/dcrcwe3-8336701.pdf?src-supplier=Avnet; ComponentLink9Description: https://datasheet.ciiva.com/8336/dcrcwe3-8336701.pdf?src-supplier=Avnet; ComponentLink10URL: https://datasheet.ciiva.com/2463/dcrcwe3-2463774.pdf?src-supplier=Digi-Key; ComponentLink10Description: https://datasheet.ciiva.com/2463/dcrcwe3-2463774.pdf?src-supplier=Digi-Key; ComponentLink11URL: https://datasheet.ciiva.com/16389/dcrcwe3-16389982.pdf?src-supplier=Future+Electronics; ComponentLink11Description: https://datasheet.ciiva.com/16389/dcrcwe3-16389982.pdf?src-supplier=Future+Electronics; ComponentLink12URL: https://datasheet.ciiva.com/16761/70201119-16761375.pdf?src-supplier=Allied+Electronics; ComponentLink12Description: https://datasheet.ciiva.com/16761/70201119-16761375.pdf?src-supplier=Allied+Electronics
R14 R22-R24 = res0402: Fixed Resistor, Metal Glaze/thick Film, 0.063W, 47000ohm, 50V, 1% +/-Tol, 100ppm/Cel, Surface Mount, 0402; Manufacturer: Vishay; Manufacturer Part Number: CRCW040247K0FKED; Power: 63mW; Value: 47kR; Temperature Coefficient: 100ppm/°C; Rated Temperature: 70°C; Package Height: 0.35mm; Package Length: 1mm; Package Width: 0.5mm; Reference Standard: AEC-Q200; ComponentLink1URL: https://datasheet.ciiva.com:443/pdfs/VipMasterIC/IC/PANA/PANA-S-A0009889626/PANA-S-A0009889626-1.pdf?src-supplier=IHS+Markit; ComponentLink1Description: https://datasheet.ciiva.com:443/pdfs/VipMasterIC/IC/PANA/PANA-S-A0009889626/PANA-S-A0009889626-1.pdf?src-supplier=IHS+Markit; ComponentLink2URL: https://datasheet.ciiva.com/6201/426256-6201373.pdf?src-supplier=Farnell; ComponentLink2Description: https://datasheet.ciiva.com/6201/426256-6201373.pdf?src-supplier=Farnell; ComponentLink3URL: https://datasheet.ciiva.com/46377/426256-46377550.pdf?src-supplier=Element14; ComponentLink3Description: https://datasheet.ciiva.com/46377/426256-46377550.pdf?src-supplier=Element14; ComponentLink4URL: https://datasheet.ciiva.com/22749/1678782-22749610.pdf?src-supplier=Element14; ComponentLink4Description: https://datasheet.ciiva.com/22749/1678782-22749610.pdf?src-supplier=Element14; ComponentLink5URL: https://datasheet.ciiva.com/28695/1678782-28695781.pdf?src-supplier=Element14; ComponentLink5Description: https://datasheet.ciiva.com/28695/1678782-28695781.pdf?src-supplier=Element14; ComponentLink6URL: https://datasheet.ciiva.com/16766/70260748-16766015.pdf?src-supplier=Allied+Electronics; ComponentLink6Description: https://datasheet.ciiva.com/16766/70260748-16766015.pdf?src-supplier=Allied+Electronics; ComponentLink7URL: https://datasheet.ciiva.com/16765/70260748-16765054.pdf?src-supplier=Allied+Electronics; ComponentLink7Description: https://datasheet.ciiva.com/16765/70260748-16765054.pdf?src-supplier=Allied+Electronics; ComponentLink8URL: https://datasheet.ciiva.com/9181/aoa0000ce2-9181461.pdf?src-supplier=Avnet; ComponentLink8Description: https://datasheet.ciiva.com/9181/aoa0000ce2-9181461.pdf?src-supplier=Avnet; ComponentLink9URL: https://datasheet.ciiva.com/16508/aoa0000ce2-16508382.pdf?src-supplier=Future+Electronics; ComponentLink9Description: https://datasheet.ciiva.com/16508/aoa0000ce2-16508382.pdf?src-supplier=Future+Electronics; Supplier: Rs; Supplier Part Number: 6789361; RoHS: Yes; Category: Chip SMD Resistors; Stock: 1650; Pricing: 50=0.05000, 500=0.02000, 1000=0.01600, 2000=0.01400, 4000=0.01300 (CHF); Mounting Technology: Surface Mount; Pins: 2; Case/Package: 0402; Terminal Finish: Nickel; Package Shape: Rectangular; Min Operating Temperature: -55°C; Max Operating Temperature: 155°C; Tolerance: 1%; Resistor Type: FIXED RESISTOR; Construction: Chip; Package Style: SMTMeter; Technology: METAL GLAZE/THICK FILM; Termination: Wraparound; Working Voltage: 50V; Packaging: Tape and Reel; JESD-609 Code: e3; Reach SVHC Compliant: Yes; RoHS Compliant: Yes; ComponentLink10URL: https://datasheet.ciiva.com:443/pdfs/VipMasterIC/IC/VISH/VISH-S-A0007266705/VISH-S-A0007266705-1.pdf?src-supplier=IHS+Markit; ComponentLink10Description: https://datasheet.ciiva.com:443/pdfs/VipMasterIC/IC/VISH/VISH-S-A0007266705/VISH-S-A0007266705-1.pdf?src-supplier=IHS+Markit; ComponentLink11URL: https://datasheet.ciiva.com/11808/0900766b80d98824-11808993.pdf?src-supplier=Rs; ComponentLink11Description: https://datasheet.ciiva.com/11808/0900766b80d98824-11808993.pdf?src-supplier=Rs; ComponentLink12URL: https://datasheet.ciiva.com/7777/1720486-7777545.pdf?src-supplier=Element14; ComponentLink12Description: https://datasheet.ciiva.com/7777/1720486-7777545.pdf?src-supplier=Element14; ComponentLink13URL: https://datasheet.ciiva.com/3256/dcrcwe3-3256558.pdf?src-supplier=Avnet; ComponentLink13Description: https://datasheet.ciiva.com/3256/dcrcwe3-3256558.pdf?src-supplier=Avnet; ComponentLink14URL: https://datasheet.ciiva.com/3256/dcrcwe3-3256559.pdf?src-supplier=Avnet; ComponentLink14Description: https://datasheet.ciiva.com/3256/dcrcwe3-3256559.pdf?src-supplier=Avnet; ComponentLink15URL: https://datasheet.ciiva.com/7777/1697337-7777247.pdf?src-supplier=Element14; ComponentLink15Description: https://datasheet.ciiva.com/7777/1697337-7777247.pdf?src-supplier=Element14; ComponentLink16URL: https://datasheet.ciiva.com/5543/dcrcwe3-109170-5543015.pdf?src-supplier=Mouser; ComponentLink16Description: https://datasheet.ciiva.com/5543/dcrcwe3-109170-5543015.pdf?src-supplier=Mouser; ComponentLink17URL: https://datasheet.ciiva.com/16768/70201119-16768855.pdf?src-supplier=Allied+Electronics; ComponentLink17Description: https://datasheet.ciiva.com/16768/70201119-16768855.pdf?src-supplier=Allied+Electronics
R17 R25-R27 R97-R102 = res0402: Fixed Resistor, Metal Glaze/thick Film, 0.0625W, 1000ohm, 50V, 1% +/-Tol, 100ppm/Cel, Surface Mount, 0402; Manufacturer: Yageo; Manufacturer Part Number: RC0402FR-071KL; Power: 62.5mW; Rated Temperature: 70°C; Value: 1kR; Temperature Coefficient: 100ppm/°C; Additional Feature: LASER TRIMMABLE; Package Height: 0.35mm; Package Length: 1mm; Package Width: 0.5mm; ComponentLink1URL: https://datasheet.ciiva.com:443/pdfs/VipMasterIC/IC/PANA/PANA-S-A0009889626/PANA-S-A0009889626-1.pdf?src-supplier=IHS+Markit; ComponentLink1Description: https://datasheet.ciiva.com:443/pdfs/VipMasterIC/IC/PANA/PANA-S-A0009889626/PANA-S-A0009889626-1.pdf?src-supplier=IHS+Markit; ComponentLink2URL: https://datasheet.ciiva.com/6201/426256-6201373.pdf?src-supplier=Farnell; ComponentLink2Description: https://datasheet.ciiva.com/6201/426256-6201373.pdf?src-supplier=Farnell; ComponentLink3URL: https://datasheet.ciiva.com/46377/426256-46377550.pdf?src-supplier=Element14; ComponentLink3Description: https://datasheet.ciiva.com/46377/426256-46377550.pdf?src-supplier=Element14; ComponentLink4URL: https://datasheet.ciiva.com/22749/1678782-22749610.pdf?src-supplier=Element14; ComponentLink4Description: https://datasheet.ciiva.com/22749/1678782-22749610.pdf?src-supplier=Element14; ComponentLink5URL: https://datasheet.ciiva.com/28695/1678782-28695781.pdf?src-supplier=Element14; ComponentLink5Description: https://datasheet.ciiva.com/28695/1678782-28695781.pdf?src-supplier=Element14; ComponentLink6URL: https://datasheet.ciiva.com/16766/70260748-16766015.pdf?src-supplier=Allied+Electronics; ComponentLink6Description: https://datasheet.ciiva.com/16766/70260748-16766015.pdf?src-supplier=Allied+Electronics; ComponentLink7URL: https://datasheet.ciiva.com/16765/70260748-16765054.pdf?src-supplier=Allied+Electronics; ComponentLink7Description: https://datasheet.ciiva.com/16765/70260748-16765054.pdf?src-supplier=Allied+Electronics; ComponentLink8URL: https://datasheet.ciiva.com/9181/aoa0000ce2-9181461.pdf?src-supplier=Avnet; ComponentLink8Description: https://datasheet.ciiva.com/9181/aoa0000ce2-9181461.pdf?src-supplier=Avnet; ComponentLink9URL: https://datasheet.ciiva.com/16508/aoa0000ce2-16508382.pdf?src-supplier=Future+Electronics; ComponentLink9Description: https://datasheet.ciiva.com/16508/aoa0000ce2-16508382.pdf?src-supplier=Future+Electronics; Supplier: Rs; Supplier Part Number: 1987686P; RoHS: Yes; Category: Chip SMD Resistors; Stock: 58300; Pricing: 1000=0.00700, 2500=0.00700, 5000=0.00600, 10000=0.00600 (CHF); Mounting Technology: Surface Mount; Pins: 2; Terminal Finish: Nickel; Case/Package: 0402; Package Shape: Rectangular; Min Operating Temperature: -55°C; Max Operating Temperature: 155°C; Tolerance: 1%; Packaging: Tape and Reel; JESD-609 Code: e3; Construction: Chip; Resistor Type: FIXED RESISTOR; Technology: METAL GLAZE/THICK FILM; Termination: Wraparound; Working Voltage: 50V; Package Style: SMTMeter; Reach SVHC Compliant: Yes; RoHS Compliant: Yes; ComponentLink10URL: https://datasheet.ciiva.com:443/pdfs/VipMasterIC/IC/YAGO/YAGO-S-A0008145938/YAGO-S-A0008145938-1.pdf?src-supplier=IHS+Markit; ComponentLink10Description: https://datasheet.ciiva.com:443/pdfs/VipMasterIC/IC/YAGO/YAGO-S-A0008145938/YAGO-S-A0008145938-1.pdf?src-supplier=IHS+Markit
R20 R29 = res0402: Fixed Resistor, Metal Glaze/thick Film, 0.1W, 15000ohm, 50V, 1% +/-Tol, 100ppm/Cel, Surface Mount, 0402; Manufacturer: Panasonic; Manufacturer Part Number: ERJ-2RKF1502X; Power: 100mW; Value: 15kR; Temperature Coefficient: 100ppm/°C; Rated Temperature: 70°C; Package Height: 0.35mm; Package Length: 1mm; Package Width: 0.5mm; Reference Standard: AEC-Q200; ComponentLink1URL: https://datasheet.ciiva.com:443/pdfs/VipMasterIC/IC/PANA/PANA-S-A0009889626/PANA-S-A0009889626-1.pdf?src-supplier=IHS+Markit; ComponentLink1Description: https://datasheet.ciiva.com:443/pdfs/VipMasterIC/IC/PANA/PANA-S-A0009889626/PANA-S-A0009889626-1.pdf?src-supplier=IHS+Markit; ComponentLink2URL: https://datasheet.ciiva.com/6201/426256-6201373.pdf?src-supplier=Farnell; ComponentLink2Description: https://datasheet.ciiva.com/6201/426256-6201373.pdf?src-supplier=Farnell; ComponentLink3URL: https://datasheet.ciiva.com/46377/426256-46377550.pdf?src-supplier=Element14; ComponentLink3Description: https://datasheet.ciiva.com/46377/426256-46377550.pdf?src-supplier=Element14; ComponentLink4URL: https://datasheet.ciiva.com/22749/1678782-22749610.pdf?src-supplier=Element14; ComponentLink4Description: https://datasheet.ciiva.com/22749/1678782-22749610.pdf?src-supplier=Element14; ComponentLink5URL: https://datasheet.ciiva.com/28695/1678782-28695781.pdf?src-supplier=Element14; ComponentLink5Description: https://datasheet.ciiva.com/28695/1678782-28695781.pdf?src-supplier=Element14; ComponentLink6URL: https://datasheet.ciiva.com/16766/70260748-16766015.pdf?src-supplier=Allied+Electronics; ComponentLink6Description: https://datasheet.ciiva.com/16766/70260748-16766015.pdf?src-supplier=Allied+Electronics; ComponentLink7URL: https://datasheet.ciiva.com/16765/70260748-16765054.pdf?src-supplier=Allied+Electronics; ComponentLink7Description: https://datasheet.ciiva.com/16765/70260748-16765054.pdf?src-supplier=Allied+Electronics; ComponentLink8URL: https://datasheet.ciiva.com/9181/aoa0000ce2-9181461.pdf?src-supplier=Avnet; ComponentLink8Description: https://datasheet.ciiva.com/9181/aoa0000ce2-9181461.pdf?src-supplier=Avnet; ComponentLink9URL: https://datasheet.ciiva.com/16508/aoa0000ce2-16508382.pdf?src-supplier=Future+Electronics; ComponentLink9Description: https://datasheet.ciiva.com/16508/aoa0000ce2-16508382.pdf?src-supplier=Future+Electronics; Supplier: Farnell; Supplier Part Number: 2302754; RoHS: Yes; Category: Chip SMD Resistors; Stock: 18858; Pricing: 10=0.03440, 100=0.01420, 500=0.00700, 2500=0.00600, 5000=0.00510 (CHF); Mounting Technology: Surface Mount; Pins: 2; Case/Package: 0402; Terminal Finish: Nickel; Package Shape: Rectangular; Min Operating Temperature: -55°C; Max Operating Temperature: 155°C; Tolerance: 1%; Resistor Type: FIXED RESISTOR; Technology: METAL GLAZE/THICK FILM; Termination: Wraparound; Working Voltage: 50V; Construction: Rectangular; Package Style: SMTMeter; Packaging: Tape and Reel; JESD-609 Code: e3; Reach SVHC Compliant: Yes; RoHS Compliant: Yes; ComponentLink10URL: https://datasheet.ciiva.com/11821/0900766b80f80784-11821181.pdf?src-supplier=Rs; ComponentLink10Description: https://datasheet.ciiva.com/11821/0900766b80f80784-11821181.pdf?src-supplier=Rs; ComponentLink11URL: https://datasheet.ciiva.com/6138/aoa0000ce2-6138166.pdf?src-supplier=Farnell; ComponentLink11Description: https://datasheet.ciiva.com/6138/aoa0000ce2-6138166.pdf?src-supplier=Farnell; ComponentLink12URL: https://datasheet.ciiva.com/8079/426256-8079609.pdf?src-supplier=Element14; ComponentLink12Description: https://datasheet.ciiva.com/8079/426256-8079609.pdf?src-supplier=Element14; ComponentLink13URL: https://datasheet.ciiva.com/43467/1678782-43467414.pdf?src-supplier=Farnell; ComponentLink13Description: https://datasheet.ciiva.com/43467/1678782-43467414.pdf?src-supplier=Farnell; ComponentLink14URL: https://datasheet.ciiva.com/46372/1678782-46372862.pdf?src-supplier=Element14; ComponentLink14Description: https://datasheet.ciiva.com/46372/1678782-46372862.pdf?src-supplier=Element14; ComponentLink15URL: https://datasheet.ciiva.com/22687/1678782-22687068.pdf?src-supplier=Element14; ComponentLink15Description: https://datasheet.ciiva.com/22687/1678782-22687068.pdf?src-supplier=Element14; ComponentLink16URL: https://datasheet.ciiva.com/46372/1678782-46372863.pdf?src-supplier=Element14; ComponentLink16Description: https://datasheet.ciiva.com/46372/1678782-46372863.pdf?src-supplier=Element14; ComponentLink17URL: https://datasheet.ciiva.com/16778/70260748-16778682.pdf?src-supplier=Allied+Electronics; ComponentLink17Description: https://datasheet.ciiva.com/16778/70260748-16778682.pdf?src-supplier=Allied+Electronics; ComponentLink18URL: https://datasheet.ciiva.com/16765/70260748-16765542.pdf?src-supplier=Allied+Electronics; ComponentLink18Description: https://datasheet.ciiva.com/16765/70260748-16765542.pdf?src-supplier=Allied+Electronics; ComponentLink19URL: https://datasheet.ciiva.com/9193/aoa0000ce2-9193047.pdf?src-supplier=Avnet; ComponentLink19Description: https://datasheet.ciiva.com/9193/aoa0000ce2-9193047.pdf?src-supplier=Avnet; ComponentLink20URL: https://datasheet.ciiva.com/16371/aoa0000ce2-16371499.pdf?src-supplier=Future+Electronics; ComponentLink20Description: https://datasheet.ciiva.com/16371/aoa0000ce2-16371499.pdf?src-supplier=Future+Electronics
R21 R62 = res0402: Fixed Resistor, Metal Glaze/thick Film, 0.1W, 10000ohm, 50V, 1% +/-Tol, 100ppm/Cel, Surface Mount, 0402; Manufacturer: Panasonic; Manufacturer Part Number: ERJ-2RKF1002X; Power: 100mW; Value: 10kR; Temperature Coefficient: 100ppm/°C; Rated Temperature: 70°C; Package Height: 0.35mm; Package Length: 1mm; Package Width: 0.5mm; Reference Standard: AEC-Q200; Supplier: Rs; Supplier Part Number: 7325246; RoHS: Yes; Category: Chip SMD Resistors; Stock: 1630000; Pricing: 10000=0.00600, 30000=0.00500 (CHF); Mounting Technology: Surface Mount; Pins: 2; Case/Package: 0402; Terminal Finish: Nickel; Package Shape: Rectangular; Min Operating Temperature: -55°C; Max Operating Temperature: 155°C; Tolerance: 1%; Resistor Type: FIXED RESISTOR; Technology: METAL GLAZE/THICK FILM; Termination: Wraparound; Working Voltage: 50V; Construction: Rectangular; Package Style: SMTMeter; Packaging: Tape and Reel; JESD-609 Code: e3; Reach SVHC Compliant: Yes; RoHS Compliant: Yes; ComponentLink1URL: https://datasheet.ciiva.com:443/pdfs/VipMasterIC/IC/PANA/PANA-S-A0009889626/PANA-S-A0009889626-1.pdf?src-supplier=IHS+Markit; ComponentLink1Description: https://datasheet.ciiva.com:443/pdfs/VipMasterIC/IC/PANA/PANA-S-A0009889626/PANA-S-A0009889626-1.pdf?src-supplier=IHS+Markit